# Altium schematic sheet power.SchDoc: Edison Breakout
size Letter; Author: Ye-Sheng Kuo; Revision: 1; SheetTotal: 9
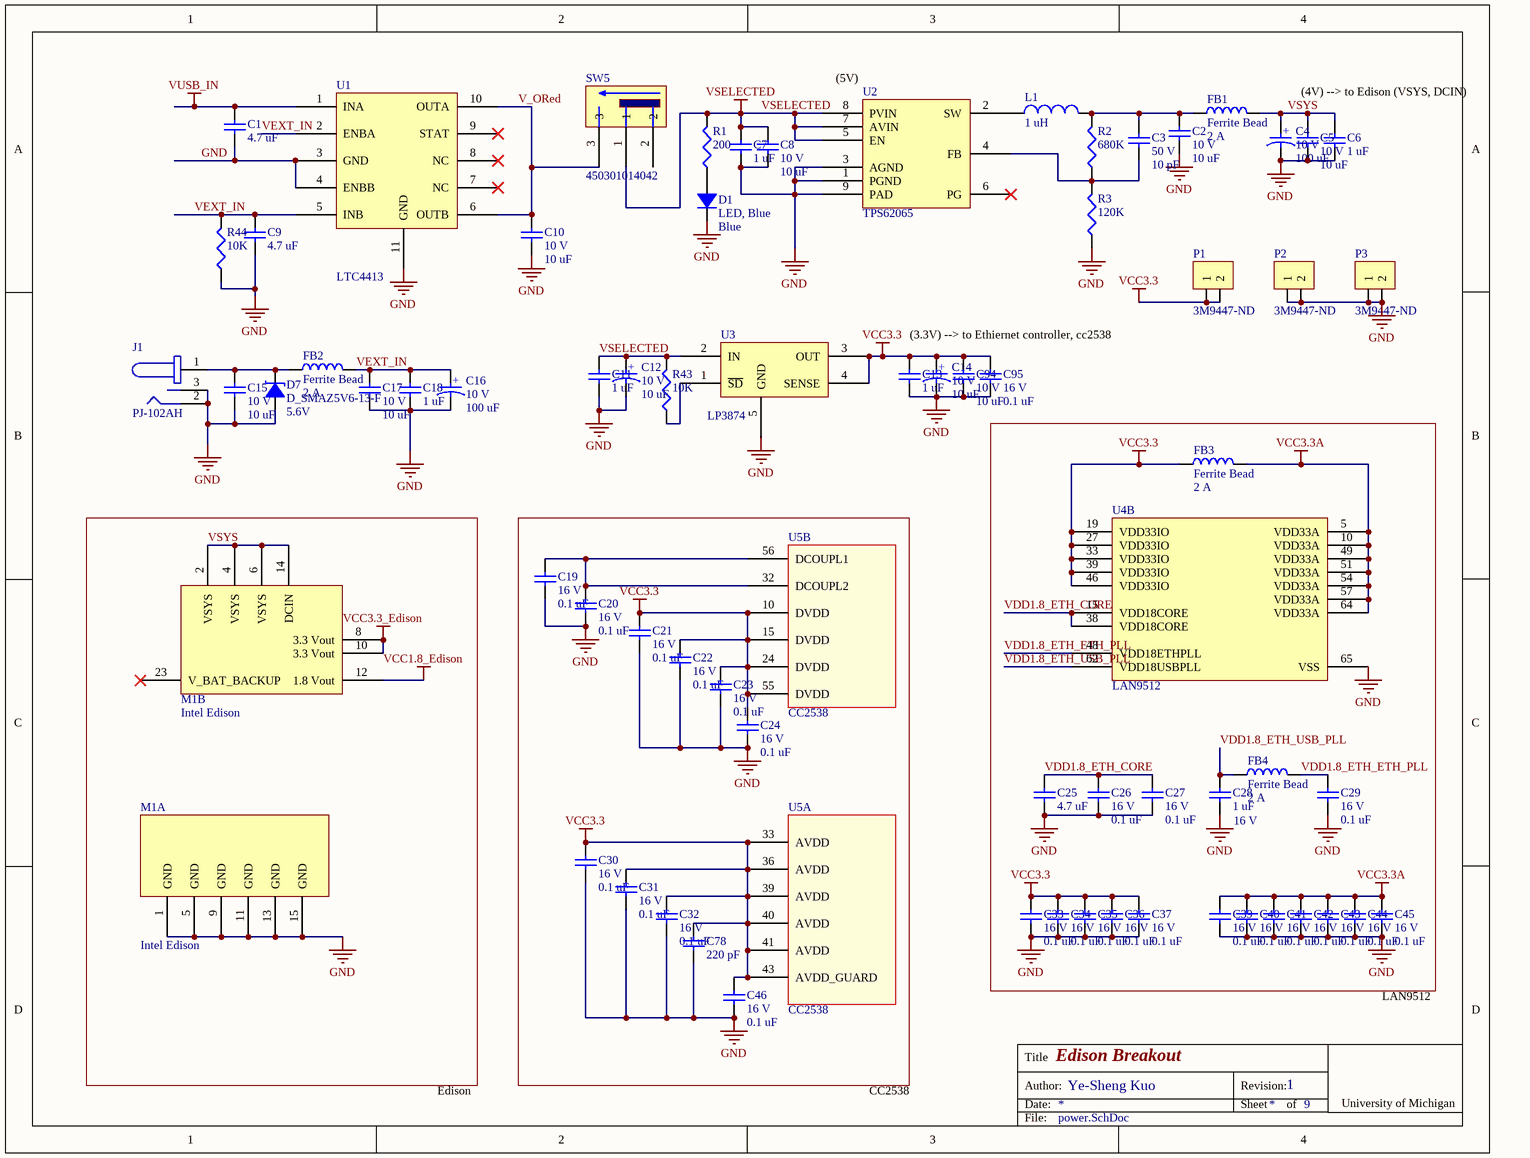
[diagram p0: power.SchDoc]

## Parts
C1  value 4.7 uF  [0603]  (hidden comment: Ceramic capacitor)
C2  value 10 uF  voltage rated: 10 V  [0603]  (hidden comment: Ceramic capacitor)
C3  value 10 pF  voltage rated: 50 V  [0402]  (hidden comment: Ceramic capacitor)
C4  value 100 uF  voltage rated: 10 V  [1206 - POLAR MARKING]  (hidden comment: Tantalum capacitor)
C5  value 10 uF  voltage rated: 10 V  [0603]  (hidden comment: Ceramic capacitor)
C6  value 1 uF  [0402]  (hidden comment: Ceramic capacitor)
C7  value 1 uF  [0402]  (hidden comment: Ceramic capacitor)
C8  value 10 uF  voltage rated: 10 V  [0603]  (hidden comment: Ceramic capacitor)
C9  value 4.7 uF  [0603]  (hidden comment: Ceramic capacitor)
C10  value 10 uF  voltage rated: 10 V  [0603]  (hidden comment: Ceramic capacitor)
C11  value 1 uF  [0402]  (hidden comment: Ceramic capacitor)
C12  value 10 uF  voltage rated: 10 V  [0603 - Polar Marking]  (hidden comment: Tantalum capacitor)
C13  value 1 uF  [0402]  (hidden comment: Ceramic capacitor)
C14  value 10 uF  voltage rated: 10 V  [0603 - Polar Marking]  (hidden comment: Tantalum capacitor)
C15  value 10 uF  voltage rated: 10 V  [0603]  (hidden comment: Ceramic capacitor)
C16  value 100 uF  voltage rated: 10 V  [1206 - POLAR MARKING]  (hidden comment: Tantalum capacitor)
C17  value 10 uF  voltage rated: 10 V  [0603]  (hidden comment: Ceramic capacitor)
C18  value 1 uF  [0402]  (hidden comment: Ceramic capacitor)
C19  value 0.1 uF  voltage rated: 16 V  [0402]  (hidden comment: Ceramic capacitor)
C20  value 0.1 uF  voltage rated: 16 V  [0402]  (hidden comment: Ceramic capacitor)
C21  value 0.1 uF  voltage rated: 16 V  [0402]  (hidden comment: Ceramic capacitor)
C22  value 0.1 uF  voltage rated: 16 V  [0402]  (hidden comment: Ceramic capacitor)
C23  value 0.1 uF  voltage rated: 16 V  [0402]  (hidden comment: Ceramic capacitor)
C24  value 0.1 uF  voltage rated: 16 V  [0402]  (hidden comment: Ceramic capacitor)
C25  value 4.7 uF  [0603]  (hidden comment: Ceramic capacitor)
C26  value 0.1 uF  voltage rated: 16 V  [0402]  (hidden comment: Ceramic capacitor)
C27  value 0.1 uF  voltage rated: 16 V  [0402]  (hidden comment: Ceramic capacitor)
C28  value 1 uF  voltage rated: 16 V  [0402]  (hidden comment: Ceramic capacitor)
C29  value 0.1 uF  voltage rated: 16 V  [0402]  (hidden comment: Ceramic capacitor)
C30  value 0.1 uF  voltage rated: 16 V  [0402]  (hidden comment: Ceramic capacitor)
C31  value 0.1 uF  voltage rated: 16 V  [0402]  (hidden comment: Ceramic capacitor)
C32  value 0.1 uF  voltage rated: 16 V  [0402]  (hidden comment: Ceramic capacitor)
C33  value 0.1 uF  voltage rated: 16 V  [0402]  (hidden comment: Ceramic capacitor)
C34  value 0.1 uF  voltage rated: 16 V  [0402]  (hidden comment: Ceramic capacitor)
C35  value 0.1 uF  voltage rated: 16 V  [0402]  (hidden comment: Ceramic capacitor)
C36  value 0.1 uF  voltage rated: 16 V  [0402]  (hidden comment: Ceramic capacitor)
C37  value 0.1 uF  voltage rated: 16 V  [0402]  (hidden comment: Ceramic capacitor)
C39  value 0.1 uF  voltage rated: 16 V  [0402]  (hidden comment: Ceramic capacitor)
C40  value 0.1 uF  voltage rated: 16 V  [0402]  (hidden comment: Ceramic capacitor)
C41  value 0.1 uF  voltage rated: 16 V  [0402]  (hidden comment: Ceramic capacitor)
C42  value 0.1 uF  voltage rated: 16 V  [0402]  (hidden comment: Ceramic capacitor)
C43  value 0.1 uF  voltage rated: 16 V  [0402]  (hidden comment: Ceramic capacitor)
C44  value 0.1 uF  voltage rated: 16 V  [0402]  (hidden comment: Ceramic capacitor)
C45  value 0.1 uF  voltage rated: 16 V  [0402]  (hidden comment: Ceramic capacitor)
C46  value 0.1 uF  voltage rated: 16 V  [0402]  (hidden comment: Ceramic capacitor)
C78  value 220 pF  [0402]  (hidden comment: Ceramic capacitor)
C94  value 10 uF  voltage rated: 10 V  [0603]  (hidden comment: Ceramic capacitor)
C95  value 0.1 uF  voltage rated: 16 V  [0402]  (hidden comment: Ceramic capacitor)
D1  LED, Blue  Color: Blue  [0402 - DIODE]
D7  D_SMAZ5V6-13-F  Zf: 5.6V  [SMAZ5V1]
FB1  Ferrite Bead  current rating: 2 A  [0603]
FB2  Ferrite Bead  current rating: 2 A  [0603]
FB3  Ferrite Bead  current rating: 2 A  [0603]
FB4  Ferrite Bead  current rating: 2 A  [0603]
J1  PJ-102AH  [PJ-102AH]
L1  value 1 uH  [1210]  (hidden comment: Chip inductor)
M1  Intel Edison  [Intel Edison mating]  (parts A,B of 5)
P1  Supplier Part Number 1: 3M9447-ND  [1x2 header]  (hidden comment: 1 x 2 header)
P2  Supplier Part Number 1: 3M9447-ND  [1x2 header]  (hidden comment: 1 x 2 header)
P3  Supplier Part Number 1: 3M9447-ND  [1x2 header]  (hidden comment: 1 x 2 header)
R1  value 200  [0402]  (hidden comment: Chip resistor)
R2  value 680K  [0402]  (hidden comment: Chip resistor)
R3  value 120K  [0402]  (hidden comment: Chip resistor)
R43  value 10K  [0402]  (hidden comment: Chip resistor)
R44  value 10K  [0402]  (hidden comment: Chip resistor)
SW5  450301014042  [450301014042]
U1  LTC4413  [DFN-10]
U2  TPS62065  [PWSON-8]
U3  LP3874  [SOT150P700X180-5N]
U4  LAN9512  [QFN-64]  (part B of 5)
U5  CC2538  [QFN56]  (parts A,B of 6)

## Nets
GND: C1.2 C2.2 C4.2 C5.2 C6.2 C7.2 C8.2 C9.2 C10.2 C11.2 C12.2 C13.2 C14.2 C15.2 C16.2 C17.2 C18.2 C19.2 C20.2 C21.2 C22.2 C23.2 C24.2 C25.2 C26.2 C27.2 C28.2 C29.2 C30.2 C31.2 C32.2 C33.2 C34.2 C35.2 C36.2 C37.2 C39.2 C40.2 C41.2 C42.2 C43.2 C44.2 C45.2 C46.2 C78.2 C94.2 C95.2 D1.2 D7.1 J1.2 J1.3 M1.1(GND) M1.5(GND) M1.9(GND) M1.11(GND) M1.13(GND) M1.15(GND) P2.1 P2.2 P3.1 P3.2 R3.2 R44.2 U1.3(GND) U1.4(ENBB) U1.11(GND) U2.1(PGND) U2.3(AGND) U2.9(PAD) U3.5(GND) U4.65(VSS)
VCC1.8_Edison: M1.12(1.8_Vout)
VCC3.3: C13.1 C14.1 C21.1 C22.1 C23.1 C24.1 C30.1 C31.1 C32.1 C33.1 C34.1 C35.1 C36.1 C37.1 C46.1 C78.1 C94.1 C95.1 FB3.2 P1.1 P1.2 U3.3(OUT) U3.4(SENSE) U4.19(VDD33IO) U4.27(VDD33IO) U4.33(VDD33IO) U4.39(VDD33IO) U4.46(VDD33IO) U5.10(DVDD) U5.15(DVDD) U5.24(DVDD) U5.33(AVDD) U5.36(AVDD) U5.39(AVDD) U5.40(AVDD) U5.41(AVDD) U5.43(AVDD_GUARD) U5.55(DVDD)
VCC3.3_Edison: M1.8(3.3_Vout) M1.10(3.3_Vout)
VCC3.3A: C39.1 C40.1 C41.1 C42.1 C43.1 C44.1 C45.1 FB3.1 U4.5(VDD33A) U4.10(VDD33A) U4.49(VDD33A) U4.51(VDD33A) U4.54(VDD33A) U4.57(VDD33A) U4.64(VDD33A)
VSELECTED: C7.1 C8.1 C11.1 C12.1 R1.1 R43.1 SW5.1 U2.5(EN) U2.7(AVIN) U2.8(PVIN) U3.2(IN)
VUSB_IN: C1.1 U1.1(INA)
V_ORed: C10.1 SW5.3 U1.6(OUTB) U1.10(OUTA)
VDD1.8_ETH_CORE: C25.1 C26.1 C27.1 U4.15(VDD18CORE) U4.38(VDD18CORE)
VDD1.8_ETH_ETH_PLL: C29.1 FB4.1 U4.48(VDD18ETHPLL)
VDD1.8_ETH_USB_PLL: C28.1 FB4.2 U4.62(VDD18USBPLL)
VEXT_IN: C9.1 C16.1 C17.1 C18.1 FB2.1 R44.1 U1.2(ENBA) U1.5(INB)
VSYS: C4.1 C5.1 C6.1 FB1.1 M1.2(VSYS) M1.4(VSYS) M1.6(VSYS) M1.14(DCIN)
NetC2_1: C2.1 C3.1 FB1.2 L1.1 R2.1
NetC3_2: C3.2 R2.2 R3.1 U2.4(FB)
NetC15_1: C15.1 D7.2 FB2.2 J1.1
NetC19_1: C19.1 C20.1 U5.32(DCOUPL2) U5.56(DCOUPL1)
NetD1_1: D1.1 R1.2
NetL1_2: L1.2 U2.2(SW)
NetR43_2: R43.2 U3.1(~{SD})

Not connected (* = marked no-connect by the designer): M1 23(V_BAT_BACKUP)*; SW5 2; U1 7(NC)* 8(NC)* 9(STAT)*; U2 6(PG)*

## Notes on the sheet
- (near U2) (5V)
- (4V) --> to Edison (VSYS, DCIN)
- (3.3V) --> to Ethiernet controller, cc2538
- LAN9512
- Edison
- CC2538
- Title
- Date:
- Author:
- Revision:
- Sheet
- of
- University of Michigan
- File:
- (in symbol C_10u_10V_0603_tantalum) +
- (in symbol C_100u_10V_1206_tantalum) +

## Library data of the parts
C1 C9 C25 = C_4.7u_10V_0603_ceramic: Ceramic capacitor, 4.7u, 10V, 0603 package; Manufacture: TDK; tolerance: 20%; Temp rating: X5R; package: 0603; voltage rated: 10 V; Supplier 1: Digi-Key; Supplier Part Number 1: 445-7482-1-ND
C2 C5 C8 C10 C15 C17 C94 = C_10u_10V_0603_ceramic: Ceramic capacitor, 10 uF, 10 V, 0603 package; Manufacture: Murata; tolerance: 20%; Temperature Coefficient: X5R; package: 0603; Supplier 1: Digi-Key; Supplier Part Number 1: 490-7197-1-ND
C3 = C_10p_50V_0402_ceramic: Ceramic capacitor, 10 pF, 16 V, 0402 package; Manufacture: Murata; tolerance: 1%; Temperature Coefficient: C0G; package: 0402; Supplier 1: Digi-Key; Supplier Part Number 1: 490-6186-1-ND
C4 C16 = C_100u_10V_1206_tantalum: Tantalum capacitor, 100 uF, 10 V, 1206 package; Manufacture: AVX; tolerance: 20%; package: 1206; Supplier 1: Digi-Key; Supplier Part Number 1: 478-6251-1-ND
C6 C7 C11 C13 C18 C28 = C_1u_16V_0402_ceramic: Ceramic capacitor, 1 uF, 16V, 0402 package; Manufacture: TDK; tolerance: 10%; Temperature rating: X5R; package: 0402; Supplier 1: Digi-Key; Supplier Part Number 1: 445-4978-1-ND
  C6 C7 C11 C13 C18: voltage rated: 16 V
C12 C14 = C_10u_10V_0603_tantalum: Tantalum capacitor, 10 uF, 10 V, 0603 package; Manufacture: Rohm Semiconductor; tolerance: 10%; ESR: 9 Ω; package: 0603; Supplier 1: Digi-Key; Supplier Part Number 1: 511-1679-1-ND
C19-C24 C26 C27 C29-C37 C39-C46 C95 = C_0.1u_16V_0402_ceramic: Ceramic capacitor, 0.1u, 16 V, 0402 package; Manufacture: Murata; tolerance: 10%; Temperature Coef: X7R; package: 0402; Supplier 1: Digi-Key; Supplier Part Number 1: 490-3261-1-ND
C78 = C_220p_50V_0402_ceramic: Ceramic capacitor, 220 pF, 0402 package; Manufacture: Johanson; voltage rated: 50 V; tolerance: 10%; package: 0402; Temperature: X7R; Supplier 1: Digi-Key; Supplier Part Number 1: 445-1254-1-ND
D1 = D_LED_BLUE_0402: LED, Blue, 0402; Forward Voltage: 2.9 V; Current @ VF: 5 mA; package: 0402; Supplier 1: Digi-Key; Supplier Part Number 1: 511-1615-1-ND
D7 = D_SMAZ5V6-13-F: SURFACE MOUNT ZENER DIODE; Supplier 1: Digi-Key; Supplier Part Number 1: SMAZ5V6-FDICT-ND
FB1-FB4 = FB_2A_0603: Ferrite Bead, 2 A, 0603 package; DC resistance: 50 m; package: 0603; Supplier 1: Digi-Key; Supplier Part Number 1: 553-2387-1-ND
J1 = PJ-102AH: CONN PWR JACK 2.1X5.5MM HIGH CUR; Supplier 1: Digi-Key; Supplier Part Number 1: CP-102AH-ND
L1 = L_1u_LQM32PN: Chip inductor, 1 uH, 1210 package, LQM32PN; tolerance: 20%; package: 1210; Supplier 1: Digi-Key; Supplier Part Number 1: 490-10767-1-ND
P1-P3 = 1 x 2 header: 100 mils standard header; Supplier 1: Digi-Key
R1 = R_200_0402: Chip resistor, 200, 0402 package; tolerance: 1%; power: 1/16 W; package: 0402; Supplier 1: Digi-Key; Supplier Part Number 1: 541-200LCT-ND
R2 = R_680K_0402: Chip resistor, 680K, 0402 package; tolerance: 1%; power: 1/16 W; package: 0402; Supplier 1: Digi-Key; Supplier Part Number 1: 541-680KLCT-ND
R3 = R_120K_0402: Chip resistor, 120K, 0402 package; tolerance: 1%; power: 1/16 W; package: 0402; Supplier 1: Digi-Key; Supplier Part Number 1: 541-120KLCT-ND
R43 R44 = R_10K_0402: Chip resistor, 10K, 0402 package; tolerance: 1%; power: 1/16 W; package: 0402; Supplier 1: Digi-Key; Supplier Part Number 1: 541-10.0KLCT-ND
SW5 = 450301014042: Slide switch, SPDT, 500 mA, 12 V; Supplier 1: Digi-Key; Supplier Part Number 1: 450301014042-ND
U1 = LTC4413: Dual 2.6A, 2.5V to 5.5V,  Ideal Diodes in 3mm × 3mm DFN; Supplier 1: Digi-Key; Supplier Part Number 1: LTC4413EDD#TRPBFCT-ND
U2 = TPS62065: 3-MHz, 2-A, Step-Down Converter; Supplier 1: Digi-Key; Supplier Part Number 1: 296-27204-1-ND
U3 = LP3874: LP387x 0.8-A Fast Ultra-Low-Dropout Linear Regulators; Supplier 1: Digi-Key; Supplier Part Number 1: LP3874EMP-3.3/NOPBCT-ND
U4 = LAN9512: USB 2.0 Hub and 10/100  Ethernet Controller; Supplier 1: Digi-Key; Supplier Part Number 1: 638-1086-ND
U5 = CC2538: A Powerful System-On-Chip for 2.4-GHz IEEE 802.15.4, 6LoWPAN  and ZigBee Applications; Supplier 1: Digi-Key; Supplier Part Number 1: 296-35797-1-ND